# Altium schematic sheet Sheet1.SchDoc
size A4; SheetNumber: 1; SheetTotal: 1
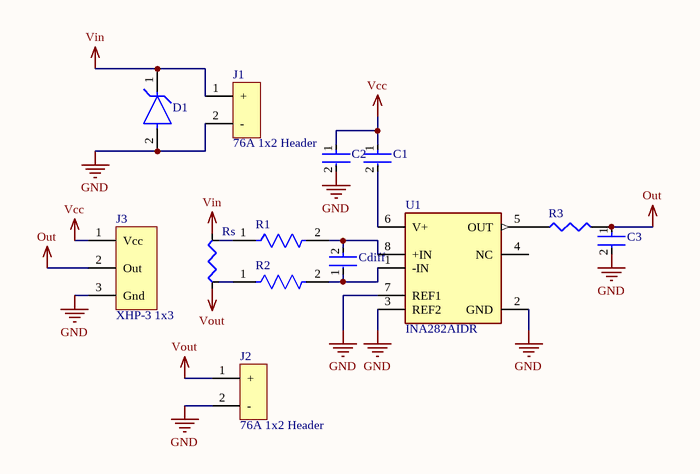
[diagram p0: Sheet1.SchDoc]

## Parts
C1  0603B104K500CT  [FP-0603B104K500CT-IPC_C]  (value not drawn)
C2  CL21B105KBFNFNE  [FP-CL21-IPC_C]  (value not drawn)
C3  C0805C103J5RAC7210  [FP-C0805C-DN-MFG]  (value not drawn)
Cdiff  C1608C0G1H103J080AA  [FP-C1608-080-0_1-IPC_C]  (value not drawn)
D1  SMAJ33A  [FP-SMAJ-MFG]  (value not drawn)
J1  76A 1x2 Header
J2  76A 1x2 Header
J3  XHP-3 1x3
R1  TNPW060310R0BEEA  [FP-TNPW0603-e3-IPC_B]  (value not drawn)
R2  TNPW060310R0BEEA  [FP-TNPW0603-e3-IPC_B]  (value not drawn)
R3  TNPW060310R0FEEA  (value not drawn)
Rs  LRMAP3920C-R001FT  (value not drawn)
U1  INA282AIDR  [FP-D0008A-MFG]

## Nets
GND: C2.2 C3.2 D1.2(A) J1.2(-) J2.2(-) J3.3(Gnd) U1.2(GND) U1.3(REF2) U1.7(REF1)
Out: C3.1 J3.2(Out) R3.2
Vcc: C1.1 C2.1 J3.1(Vcc)
Vin: D1.1(C) J1.1(+) Rs.2
Vout: J2.1(+) Rs.1
NetC1_2: C1.2 U1.6(V+)
NetCdiff_1: Cdiff.1 R2.2 U1.1(-IN)
NetCdiff_2: Cdiff.2 R1.2 U1.8(+IN)
NetR1_1: R1.1 Rs.3(S+)
NetR2_1: R2.1 Rs.4(S-)
NetR3_1: R3.1 U1.5(OUT)

Not connected (* = marked no-connect by the designer): U1 4(NC)

## Library data of the parts
C1 = CMP-45632-000007-1: CAP CER 0.1UF 50V X7R 0603; Tolerance: 10%; Capacitance: 100nF; Radiation Hardening: No; Depth: 0.8mm; Length: 1.6mm; Voltage Rating: 50V; Dielectric: X7R; Case/Package: 0603; RoHS Compliant: Yes; Case Code (Metric): 1608; Voltage Rating (DC): 50V; Min Operating Temperature: -55°C; Series: -; Max Operating Temperature: 125°C; Lead Free: Lead Free; Case Code (Imperial): 0603; Packaging: Tape and Reel
C2 = CMP-13271-004196-1: CL21 Series 0805 1uF 50V ±10% Tolerance X7R Multilayer Ceramic Chip Capacitor; Tolerance: 10%; Thickness: 0.053inch; Case/Package: 0805; Mount: Surface Mount; Depth: 1.25mm; Radiation Hardening: No; Voltage Rating: 50V; Max Operating Temperature: 125°C; Case Code (Imperial): 0805; Min Operating Temperature: -55°C; Length: 0.079inch; Dielectric: X7R; Case Code (Metric): 2012; Packaging: Tape and Reel; Width: 0.049inch; Package Quantity: 1; Capacitance: 1uF; Height: 1.25mm
C3 = CMP-2007-01173-3: CAP CER SMD 0805 .01UF X7R 5% 50; Manufacturer: KEMET; Value: 10,000 pF; Temperature Coefficient: 30ppm/°C; Tolerance: 0.05; Voltage Rating: 50 V; Material: Ceramic; Digikey Description: CAP CER SMD 0805 .01UF X7R 5% 50; Temperature Characteristic: X7R; Manufacturer Part Number: C0805C103J5RAC7210; ComponentLink2URL: https://content.kemet.com/datasheets/KEM_C1003_C0G_SMD.pdf; ComponentLink2Description: Datasheet; Temperature Range High: +125°C; Package: C0805C-DN; Category: Cap; RoHS: TRUE; Device Class L1: Passive Components; Ipc Land Pattern Name: CAPC200125X78; Mouser Description: Cap Ceramic 0.01uF 50V X7R 5% Pad SMD 0805 125C T/R; Temperature: -55°C to +125°C; Octopart: https://octopart.com/c0805c103j5rac7210-kemet-3921106; Capacitance: 10,000 pF; Height: 0.88mm; Temperature Range Low: -55°C; Device Class L3: Ceramic Capacitors; Device Class L2: Capacitors; Lead Free: Yes; Automotive: No
Cdiff = CMP-08246-003621-1: Multilayer Ceramic Capacitors 10nF ±5% 50V C0G SMD 0603; Temperature Coefficient: 30ppm/°C; Capacitance: 10nF; Termination: SMD/SMT; Case Code (Imperial): 0603; Max Operating Temperature: 125°C; Weight: 7.1E-05oz; Construction: Flat; Voltage Rating (DC): 50V; Package Quantity: 1; Thickness: 0.035inch; Dielectric Material: Ceramic; Height: 0.8mm; Tolerance: 5%; Series: C; Depth: 0.8mm; Radiation Hardening: No; Mount: Surface Mount; RoHS Compliant: Yes; Voltage Rating: 50V; Case/Package: 0603; Number of Pins: 2; Voltage: 50V; Min Operating Temperature: -55°C; Dielectric: C0G; REACH SVHC: No SVHC; Width: 0.031inch; Lead Free: Lead Free; Length: 1.6mm; Packaging: Tape and Reel; Case Code (Metric): 1608
D1 = CMP-08607-000030-1: TVS DIODE 33V 53.3V DO214AC; Manufacturer: Littelfuse Inc; Peak Pulse Current: 7.5A; Number Of Channels: 1; Breakdown Voltage: 36.7V; Peak Pulse Power: 400W; Direction: Unidirectional; Max Junction Temp: +150°C; Temperature Range High: +150°C; Clamping Voltage: 53.3V; Height: 2.29mm; Lead Free: Yes; Temperature: -65°C to +150°C; Temperature Range Low: -65°C; Mouser Description: SMAJ Series 53.3 V 0.4 kW Surface Mount Uni-Directional TVS Diode - DO-214AC; Device Class L1: Circuit Protection; ComponentLink2Description: Datasheet; Manufacturer Part Number: SMAJ33A; Category: Diode; Package: SMAJ; Device Class L3: unset; RoHS: TRUE; ComponentLink2URL: https://www.littelfuse.com/~/media/electronics/datasheets/tvs_diodes/littelfuse_tvs_diode_smaj_datasheet.pdf.pdf; Automotive: No; Reverse Standoff Voltage: 33V; Octopart: https://octopart.com/smaj33a-littelfuse-350074; Digikey Description: TVS DIODE 33V 53.3V DO214AC; Device Class L2: TVS Diodes
J1 J2 = 1773976: Conn PC Board Terminal Block 2 POS 10.16mm RA Through Hole 76A Cardboard; Manufacturer: Phoenix Contact; Approvals: CB, UL, VDE, cUL; Current: 60A; Number of Circuits: 2; Number of Levels: 1; Voltage: 600V; Voltage Rating: 1kV; Voltage Rating (DC): 690V; Wire/Cable Gauge: 6AWG; Wire Gauge (Max): 20AWG; Supplier: RS; Supplier Part Number: 2482380; Manufacturer Part Number: 1773976; RoHS: Compliant; Category: Terminal Blocks; Stock: 50; Ambient Temperature Range High: 100°C; China RoHS: Compliant; Color: Green; Contact Material: Nickel, Tin; Current Rating: 76A; Height: 29.5mm; Housing Color: Green; Housing Material: Nylon; Lead Free: Lead Free; Lead Pitch: 10.16mm; Lifecycle Status: Production; Max Current Rating: 76A; Max Operating Temperature: 100°C; Min Operating Temperature: -40°C; Mounting Technology: Screw; Number of Contacts: 2; Pins: 2; Number of Poles: 2; Number of Positions: 2; Number of Positions Per Level: 2; Number of Rows: 1; Orientation: Right Angle; Packaging: Bulk; Pitch: 10.16mm; REACH SVHC: Yes; Termination: Screw; Voltage Rating (AC): 1kV; Weight: 15.331989g; Width: 34.3mm; Wire Gauge (Min): 20AWG; ComponentLink1URL: https://datasheet.octopart.com:443/1773976-Phoenix-Contact-datasheet-181079788.pdf?src-supplier=IHS; ComponentLink1Description: https://datasheet.octopart.com:443/1773976-Phoenix-Contact-datasheet-181079788.pdf?src-supplier=IHS; ComponentLink2URL: https://datasheet.octopart.com:443/1773976-Phoenix-Contact-datasheet-86450949.pdf?src-supplier=Farnell; ComponentLink2Description: https://datasheet.octopart.com:443/1773976-Phoenix-Contact-datasheet-86450949.pdf?src-supplier=Farnell; ComponentLink3URL: https://datasheet.octopart.com:443/MKDSP-10N/2-10%2C16-Phoenix-Contact-datasheet-8611737.pdf?src-supplier=element14+APAC; ComponentLink3Description: https://datasheet.octopart.com:443/MKDSP-10N/2-10%2C16-Phoenix-Contact-datasheet-8611737.pdf?src-supplier=element14+APAC; ComponentLink4URL: https://datasheet.octopart.com:443/1773976-Phoenix-Contact-datasheet-169855936.pdf?src-supplier=Master+Electronics; ComponentLink4Description: https://datasheet.octopart.com:443/1773976-Phoenix-Contact-datasheet-169855936.pdf?src-supplier=Master+Electronics; ComponentLink5URL: https://datasheet.octopart.com:443/1773976-Phoenix-Contact-datasheet-62122673.pdf?src-supplier=Master+Electronics; ComponentLink5Description: https://datasheet.octopart.com:443/1773976-Phoenix-Contact-datasheet-62122673.pdf?src-supplier=Master+Electronics; ComponentLink6URL: https://datasheet.octopart.com:443/1773976-Phoenix-Contact-datasheet-154780030.pdf?src-supplier=Electro+Sonic; ComponentLink6Description: https://datasheet.octopart.com:443/1773976-Phoenix-Contact-datasheet-154780030.pdf?src-supplier=Electro+Sonic; ComponentLink7URL: https://datasheet.octopart.com:443/1773976-Phoenix-Contact-datasheet-9630229.pdf?src-supplier=TodayComponents; ComponentLink7Description: https://datasheet.octopart.com:443/1773976-Phoenix-Contact-datasheet-9630229.pdf?src-supplier=TodayComponents; ComponentLink8URL: https://datasheet.octopart.com:443/1773976-Phoenix-Contact-datasheet-177331518.pdf?src-supplier=Burklin+Elektronik; ComponentLink8Description: https://datasheet.octopart.com:443/1773976-Phoenix-Contact-datasheet-177331518.pdf?src-supplier=Burklin+Elektronik; ComponentLink9URL: https://datasheet.octopart.com:443/1773976-Phoenix-Contact-datasheet-62053912.pdf?src-supplier=TME; ComponentLink9Description: https://datasheet.octopart.com:443/1773976-Phoenix-Contact-datasheet-62053912.pdf?src-supplier=TME; ComponentLink10URL: https://datasheet.octopart.com:443/1773976-Phoenix-Contact-datasheet-33478615.pdf?src-supplier=MRO+Stop; ComponentLink10Description: https://datasheet.octopart.com:443/1773976-Phoenix-Contact-datasheet-33478615.pdf?src-supplier=MRO+Stop
J3 = XHP-3: Connector Housing, XH Series, 3 Positions, 2.50mm, 250V, 30-22 AWG, Crimp, In-Line, Natural; Manufacturer: JST; Connector Type: Receptacle, Socket; Contact Resistance: 10mΩ; Current Rating: 3A; Gender: Receptacle; Insulation Resistance: 1GΩ; Number of Contacts: 3; Pitch: 2.5mm; Wire/Cable Gauge: 22AWG; Wire Gauge (Min): 30AWG; Supplier: RS; Supplier Part Number: 8201614; Manufacturer Part Number: XHP-3; RoHS: Compliant; Category: Card Edge Connectors; Stock: 20335; China RoHS: Compliant; Color: Natural; Contact Gender: Female; Contact Material: Bronze, Tin; Depth: 7.75mm; Height: 6.35mm; Housing Color: White; Housing Material: Polyamide; Lead Free: Lead Free; Length: 9.8mm; Lifecycle Status: Production; Max Current Rating: 3A; Max Operating Temperature: 85°C; Max Voltage Rating (AC): 250V; Max Voltage Rating (DC): 250V; Min Operating Temperature: -25°C; Mounting Technology: Cable, Free Hanging; Pins: 3; Number of Positions: 3; Number of Rows: 1; Orientation: Straight; REACH SVHC: No; Termination: Crimp; Voltage Rating: 250V; Voltage Rating (AC): 250V; Weight: 28.349523g; Width: 5.7mm; Wire Gauge (Max): 22AWG; ComponentLink1URL: https://datasheet.octopart.com:443/XHP-3-JST-datasheet-12510042.pdf?src-supplier=Upverter; ComponentLink1Description: https://datasheet.octopart.com:443/XHP-3-JST-datasheet-12510042.pdf?src-supplier=Upverter; ComponentLink2URL: https://datasheet.octopart.com:443/XHP-3-JST-datasheet-8325564.pdf?src-supplier=Burklin+Elektronik; ComponentLink2Description: https://datasheet.octopart.com:443/XHP-3-JST-datasheet-8325564.pdf?src-supplier=Burklin+Elektronik; ComponentLink3URL: https://datasheet.octopart.com:443/XHP-3-JST-datasheet-180492027.pdf?src-supplier=IHS; ComponentLink3Description: https://datasheet.octopart.com:443/XHP-3-JST-datasheet-180492027.pdf?src-supplier=IHS; ComponentLink4URL: https://datasheet.octopart.com:443/XHP-3-JST-datasheet-62330224.pdf?src-supplier=element14+APAC; ComponentLink4Description: https://datasheet.octopart.com:443/XHP-3-JST-datasheet-62330224.pdf?src-supplier=element14+APAC; ComponentLink5URL: https://datasheet.octopart.com:443/XHP-3-JST-datasheet-13502449.pdf?src-supplier=element14+APAC; ComponentLink5Description: https://datasheet.octopart.com:443/XHP-3-JST-datasheet-13502449.pdf?src-supplier=element14+APAC; ComponentLink6URL: https://datasheet.octopart.com:443/XHP-3-JST-datasheet-10026044.pdf?src-supplier=TME; ComponentLink6Description: https://datasheet.octopart.com:443/XHP-3-JST-datasheet-10026044.pdf?src-supplier=TME; ComponentLink7URL: https://datasheet.octopart.com:443/XHP-3-JST-datasheet-63094.pdf?src-supplier=Future+Electronics; ComponentLink7Description: https://datasheet.octopart.com:443/XHP-3-JST-datasheet-63094.pdf?src-supplier=Future+Electronics; ComponentLink8URL: https://datasheet.octopart.com:443/XHP-3-JST-datasheet-140264791.pdf?src-supplier=LKR; ComponentLink8Description: https://datasheet.octopart.com:443/XHP-3-JST-datasheet-140264791.pdf?src-supplier=LKR; ComponentLink9URL: https://datasheet.octopart.com:443/XHP-3-JST-datasheet-41261050.pdf?src-supplier=Newark; ComponentLink9Description: https://datasheet.octopart.com:443/XHP-3-JST-datasheet-41261050.pdf?src-supplier=Newark; ComponentLink10URL: https://datasheet.octopart.com:443/XHP-3-JST-datasheet-157850277.pdf?src-supplier=Amar+Radio+Corporation; ComponentLink10Description: https://datasheet.octopart.com:443/XHP-3-JST-datasheet-157850277.pdf?src-supplier=Amar+Radio+Corporation
R1 R2 = CMP-2000-03695-4: RES 10 OHM 0.1% 1/10W 0603; Max Power Dissipation: 100mW; Voltage Rating (DC): 50V; Resistance: 10R; Voltage Rating: 75V; Temperature Coefficient: 25ppm/°C; Size Code: 0603; Resistor Type: Thin Film; Number of Terminations: 2; RoHS Compliant: Yes; Radiation Hardening: No; Contact Plating: Tin; Max Operating Temperature: 125°C; Min Operating Temperature: -55°C; Military Standard: Not; Depth: 0.85mm; Lead Free: Lead Free; Case Code (Metric): 1608; Resistance Tolerance: 0.1%; Construction: Rectangular; Height: 0.45mm; Packaging: Tape and Reel; Tolerance: 0.1%; Weight: 7.1E-05oz; Case Code (Imperial): 0603; Features: Moisture Resistant; Termination: SMD/SMT; Power Rating: 100mW; Series: TNPW; Technology: THIN FILM; Package Quantity: 1; Width: 0.8mm; Case/Package: 0603; Length: 1.6mm
R3 = TNPW060310R0FEEA: Fixed Resistor, Thin Film, 0.1W, 10ohm, 75V, 1% +/-Tol, 25ppm/Cel, Surface Mount, 0603; Manufacturer: Vishay; Power Dissipation: 100mW; Value: 10Ω; Temperature Coefficient: 25ppm/°C; Supplier: Mouser; Supplier Part Number: 71-TNPW060310R0FEEA; Manufacturer Part Number: TNPW060310R0FEEA; RoHS: Compliant; Category: Chip SMD Resistors; Stock: 10888; Pricing: 1=0,21, 10=0,154, 50=0,121, 100=0,109, 1000=0,074, 10000=0,055 (USD); Case/Package: 0603; China RoHS: Compliant; Composition: Thin Film; Contact Plating: Tin; Height: 450µm; Lifecycle Status: Production; Max Operating Temperature: 125°C; Min Operating Temperature: -55°C; Mounting Technology: Surface Mount; Number of Terminals: 2; Packaging: Tape & Reel; Power Rating: 100mW; Radiation Hardening: No; REACH SVHC: Yes; Tolerance: 1%; Width: 850µm; Working Voltage: 75V; ComponentLink1URL: https://datasheet.octopart.com:443/TNPW060310R0FEEA-Vishay-datasheet-182188515.pdf?src-supplier=IHS; ComponentLink1Description: https://datasheet.octopart.com:443/TNPW060310R0FEEA-Vishay-datasheet-182188515.pdf?src-supplier=IHS; ComponentLink2URL: https://datasheet.octopart.com:443/TNPW060310R0FEEA-Vishay-Dale-datasheet-182026744.pdf?src-supplier=IHS; ComponentLink2Description: https://datasheet.octopart.com:443/TNPW060310R0FEEA-Vishay-Dale-datasheet-182026744.pdf?src-supplier=IHS; ComponentLink3URL: https://datasheet.octopart.com/TNPW060310R0FEEA-Vishay-datasheet-13498837.pdf; ComponentLink3Description: https://datasheet.octopart.com/TNPW060310R0FEEA-Vishay-datasheet-13498837.pdf; ComponentLink4URL: https://datasheet.octopart.com/TNPW060310R0FEEA-Vishay-datasheet-13414878.pdf; ComponentLink4Description: https://datasheet.octopart.com/TNPW060310R0FEEA-Vishay-datasheet-13414878.pdf; ComponentLink5URL: https://datasheet.octopart.com/TNPW060310R0FEEA-Vishay-datasheet-13295955.pdf; ComponentLink5Description: https://datasheet.octopart.com/TNPW060310R0FEEA-Vishay-datasheet-13295955.pdf; ComponentLink6URL: https://datasheet.octopart.com/TNPW060310R0FEEA-Vishay-datasheet-13196373.pdf; ComponentLink6Description: https://datasheet.octopart.com/TNPW060310R0FEEA-Vishay-datasheet-13196373.pdf; ComponentLink7URL: https://datasheet.octopart.com/TNPW060310R0FEEA-Vishay-datasheet-13143890.pdf; ComponentLink7Description: https://datasheet.octopart.com/TNPW060310R0FEEA-Vishay-datasheet-13143890.pdf; ComponentLink8URL: https://datasheet.octopart.com/TNPW060310R0FEEA-Vishay-datasheet-13081780.pdf; ComponentLink8Description: https://datasheet.octopart.com/TNPW060310R0FEEA-Vishay-datasheet-13081780.pdf; ComponentLink9URL: https://datasheet.octopart.com/TNPW060310R0FEEA-Vishay-datasheet-13052401.pdf; ComponentLink9Description: https://datasheet.octopart.com/TNPW060310R0FEEA-Vishay-datasheet-13052401.pdf; ComponentLink10URL: https://datasheet.octopart.com/TNPW060310R0FEEA-Vishay-datasheet-13034137.pdf; ComponentLink10Description: https://datasheet.octopart.com/TNPW060310R0FEEA-Vishay-datasheet-13034137.pdf; ComponentLink11URL: https://datasheet.octopart.com/TNPW060310R0FEEA-Vishay-datasheet-12585086.pdf; ComponentLink11Description: https://datasheet.octopart.com/TNPW060310R0FEEA-Vishay-datasheet-12585086.pdf; ComponentLink12URL: https://datasheet.octopart.com/TNPW060310R0FEEA-Vishay-datasheet-12543131.pdf; ComponentLink12Description: https://datasheet.octopart.com/TNPW060310R0FEEA-Vishay-datasheet-12543131.pdf; ComponentLink13URL: https://datasheet.octopart.com/TNPW060310R0FEEA-Vishay-datasheet-12532511.pdf; ComponentLink13Description: https://datasheet.octopart.com/TNPW060310R0FEEA-Vishay-datasheet-12532511.pdf; ComponentLink14URL: https://datasheet.octopart.com/TNPW060310R0FEEA-Vishay-datasheet-12519971.pdf; ComponentLink14Description: https://datasheet.octopart.com/TNPW060310R0FEEA-Vishay-datasheet-12519971.pdf; ComponentLink15URL: https://datasheet.octopart.com/TNPW060310R0FEEA-Vishay-datasheet-12509767.pdf; ComponentLink15Description: https://datasheet.octopart.com/TNPW060310R0FEEA-Vishay-datasheet-12509767.pdf; ComponentLink16URL: https://datasheet.octopart.com/TNPW060310R0FEEA-Vishay-datasheet-12365287.pdf; ComponentLink16Description: https://datasheet.octopart.com/TNPW060310R0FEEA-Vishay-datasheet-12365287.pdf; ComponentLink17URL: https://datasheet.octopart.com/TNPW060310R0FEEA-Vishay-datasheet-10854096.pdf; ComponentLink17Description: https://datasheet.octopart.com/TNPW060310R0FEEA-Vishay-datasheet-10854096.pdf; ComponentLink18URL: https://datasheet.octopart.com/TNPW060310R0FEEA-Vishay-datasheet-10678752.pdf; ComponentLink18Description: https://datasheet.octopart.com/TNPW060310R0FEEA-Vishay-datasheet-10678752.pdf; ComponentLink19URL: https://datasheet.octopart.com/TNPW060310R0FEEA-Vishay-datasheet-10283461.pdf; ComponentLink19Description: https://datasheet.octopart.com/TNPW060310R0FEEA-Vishay-datasheet-10283461.pdf; ComponentLink20URL: https://datasheet.octopart.com/TNPW060310R0FEEA-Vishay-datasheet-10185418.pdf; ComponentLink20Description: https://datasheet.octopart.com/TNPW060310R0FEEA-Vishay-datasheet-10185418.pdf; ComponentLink21URL: https://datasheet.octopart.com/TNPW060310R0FEEA-Vishay-datasheet-10055244.pdf; ComponentLink21Description: https://datasheet.octopart.com/TNPW060310R0FEEA-Vishay-datasheet-10055244.pdf; ComponentLink22URL: http://sigma.octopart.com:80/rohs_statement/Vishay-company-15.pdf?src-supplier=Compliance+Statements; ComponentLink22Description: http://sigma.octopart.com:80/rohs_statement/Vishay-company-15.pdf?src-supplier=Compliance+Statements
Rs = LRMAP3920C-R001FT (2): Fixed Resistor, Metal Strip, 5W, 0.001ohm, 1% +/-Tol, 50ppm/Cel, Surface Mount, 3920; Manufacturer: Welwyn; Value: 1mΩ; Temperature Coefficient: 50ppm/°C; Supplier: Farnell; Supplier Part Number: 4430410; Manufacturer Part Number: LRMAP3920C-R001FT; RoHS: Compliant; Category: Chip SMD Resistors; Stock: 52875; Case Code (Imperial): 3921; Case Code (Metric): 1052; Composition: Metal Alloy; Height: 1.36mm; Lifecycle Status: Production; Max Operating Temperature: 170°C; Min Operating Temperature: -55°C; Mounting Technology: Surface Mount; Number of Terminals: 2; Packaging: Cut Tape; Power Dissipation: 5W; Power Rating: 5W; REACH SVHC: Yes; Tolerance: 1%; Width: 5.2mm; ComponentLink1URL: https://datasheet.octopart.com:443/LRMAP3920C-R001FT-TT-Electronics-datasheet-182172293.pdf?src-supplier=IHS; ComponentLink1Description: https://datasheet.octopart.com:443/LRMAP3920C-R001FT-TT-Electronics-datasheet-182172293.pdf?src-supplier=IHS; ComponentLink2URL: https://datasheet.octopart.com:443/LRMAP3920C-R001FT-Welwyn-datasheet-86812730.pdf?src-supplier=Newark; ComponentLink2Description: https://datasheet.octopart.com:443/LRMAP3920C-R001FT-Welwyn-datasheet-86812730.pdf?src-supplier=Newark; ComponentLink3URL: https://datasheet.octopart.com:443/LRMAP3920C-R001FT-Welwyn-datasheet-49692119.pdf?src-supplier=Newark; ComponentLink3Description: https://datasheet.octopart.com:443/LRMAP3920C-R001FT-Welwyn-datasheet-49692119.pdf?src-supplier=Newark; ComponentLink4URL: https://datasheet.octopart.com:443/LRMAP3920C-R001FT-TT-Electronics-datasheet-182915716.pdf?src-supplier=Electro+Sonic; ComponentLink4Description: https://datasheet.octopart.com:443/LRMAP3920C-R001FT-TT-Electronics-datasheet-182915716.pdf?src-supplier=Electro+Sonic; ComponentLink5URL: https://datasheet.octopart.com:443/LRMAP3920C-R001FT-Welwyn-datasheet-58102391.pdf?src-supplier=element14+APAC; ComponentLink5Description: https://datasheet.octopart.com:443/LRMAP3920C-R001FT-Welwyn-datasheet-58102391.pdf?src-supplier=element14+APAC; ComponentLink6URL: https://datasheet.octopart.com:443/LRMAP3920C-R001FT-Welwyn-datasheet-164894312.pdf?src-supplier=Burklin+Elektronik; ComponentLink6Description: https://datasheet.octopart.com:443/LRMAP3920C-R001FT-Welwyn-datasheet-164894312.pdf?src-supplier=Burklin+Elektronik
U1 = CMP-04910-000004-1: IC CURRENT SHUNT MONITOR 8SOIC; Manufacturer: Texas Instruments; Max Supply Voltage: 18V; Standoff Height: 0.11mm; Nominal Supply Current: 600uA; Max Junction Temp: +150°C; Min Supply Voltage: 2.7V; Number Of Outputs: 1; Temperature: -40°C to +125°C; Lead Free: Yes; Manufacturer Part Number: INA282AIDR; Ambient Temperature Range High: +125°C; Octopart: https://octopart.com/ina282aidr-texas+instruments-18804707; Device Class L2: Power Management ICs; ComponentLink2Description: Datasheet; Ipc Land Pattern Name: SOIC127P600X175-8; Device Class L3: unset; Temperature Range High: +125°C; ComponentLink2URL: http://www.ti.com/lit/ds/symlink/ina282.pdf; Package: D0008A; Ambient Temperature Range Low: -40°C; RoHS: TRUE; Digikey Description: IC CURRENT SHUNT MONITOR 8SOIC; Temperature Range Low: -40°C; Mouser Description: Current & Power Monitors & Regulators Bidirectional,Hi Acc Crnt Shunt Mon; Device Class L1: Integrated Circuits (ICs); Automotive: No; Category: IC; Height: 1.75mm